# EAGLE design B5_2U_EM_RAB_Ver3 (EAGLE 9.4.2)
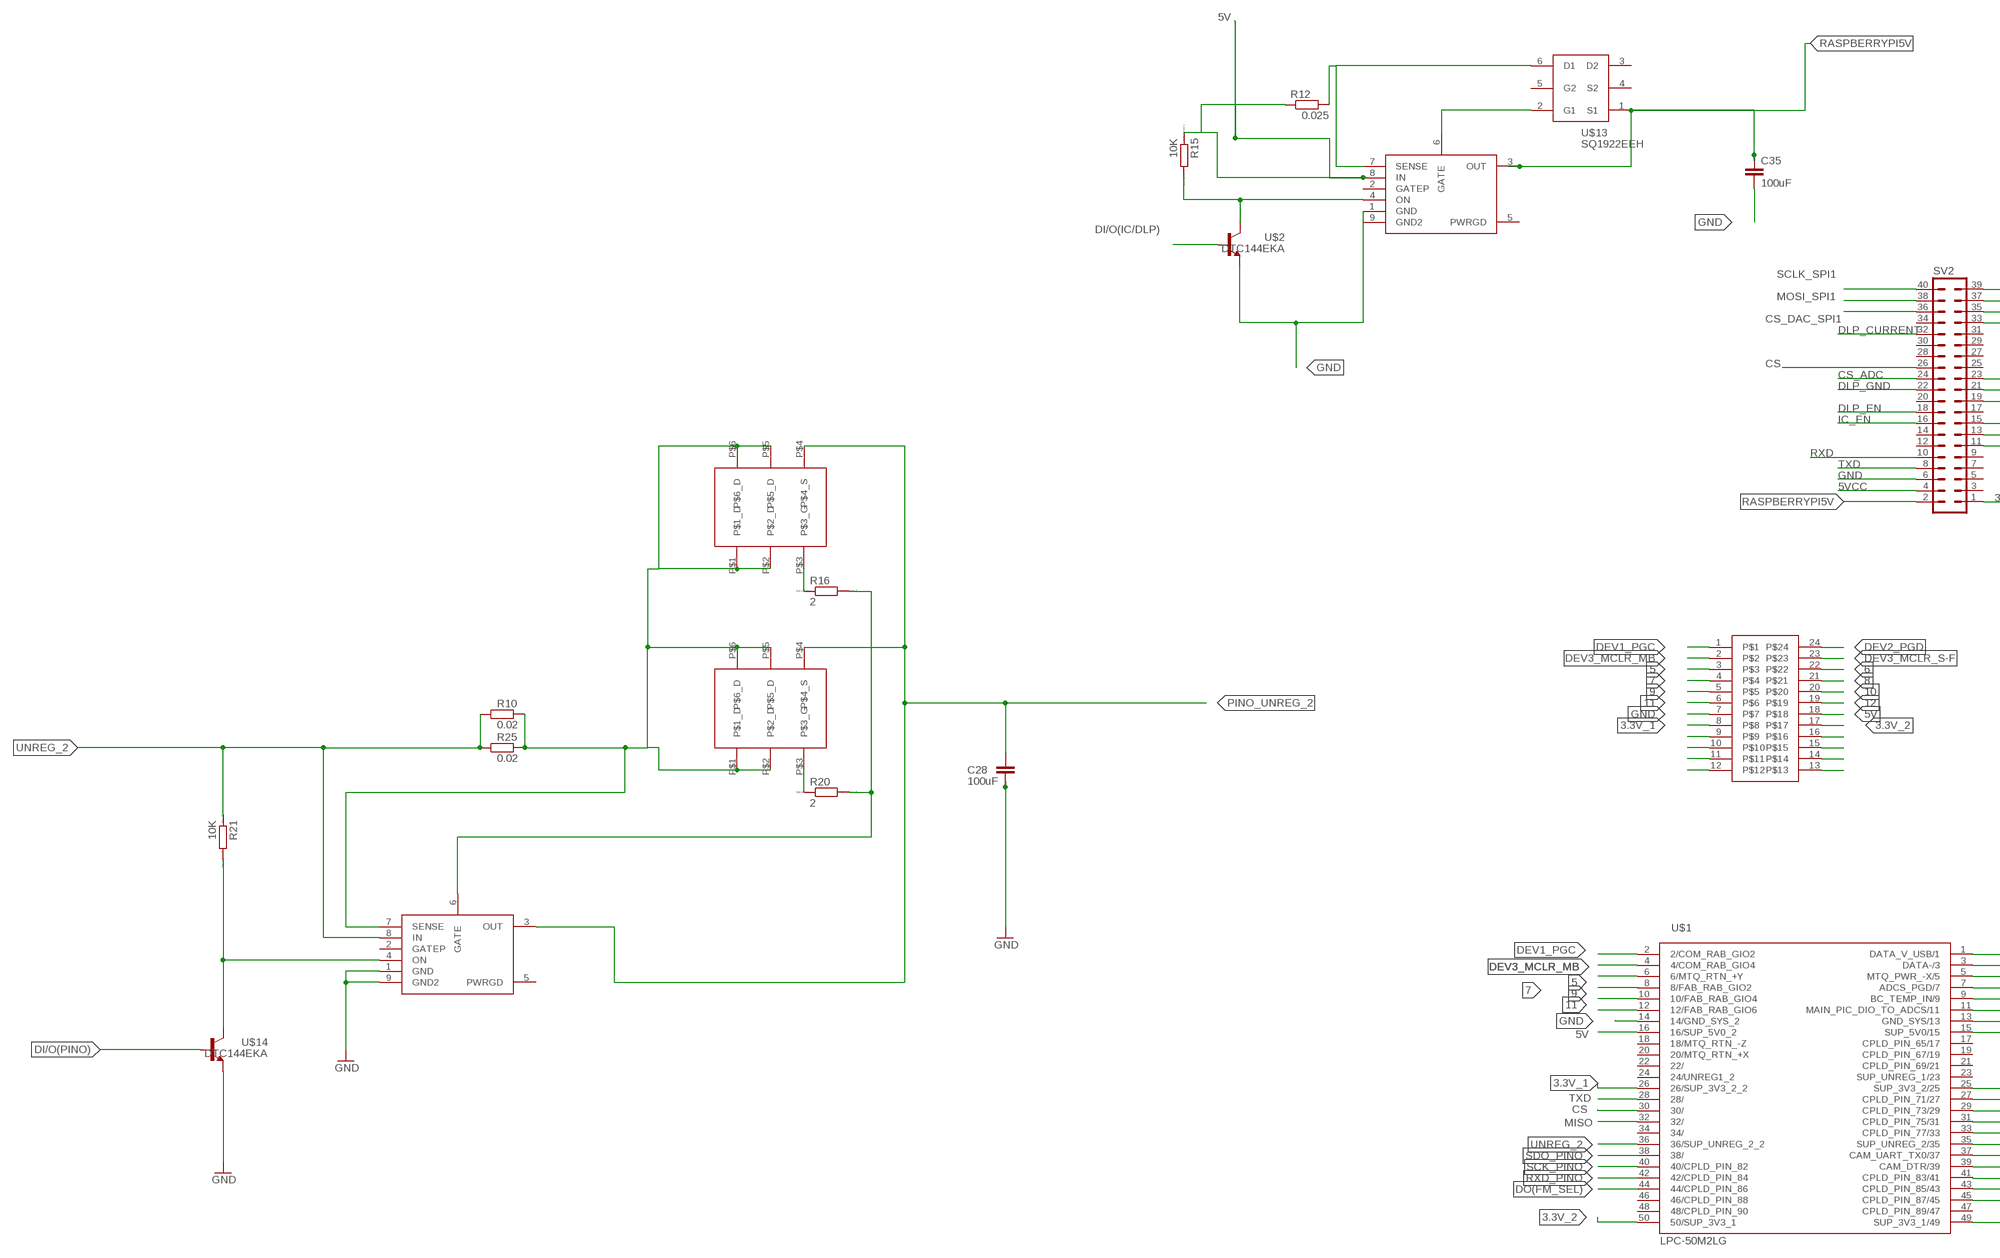
[diagram p0: schematic, sheet 1, part 1 of 2]
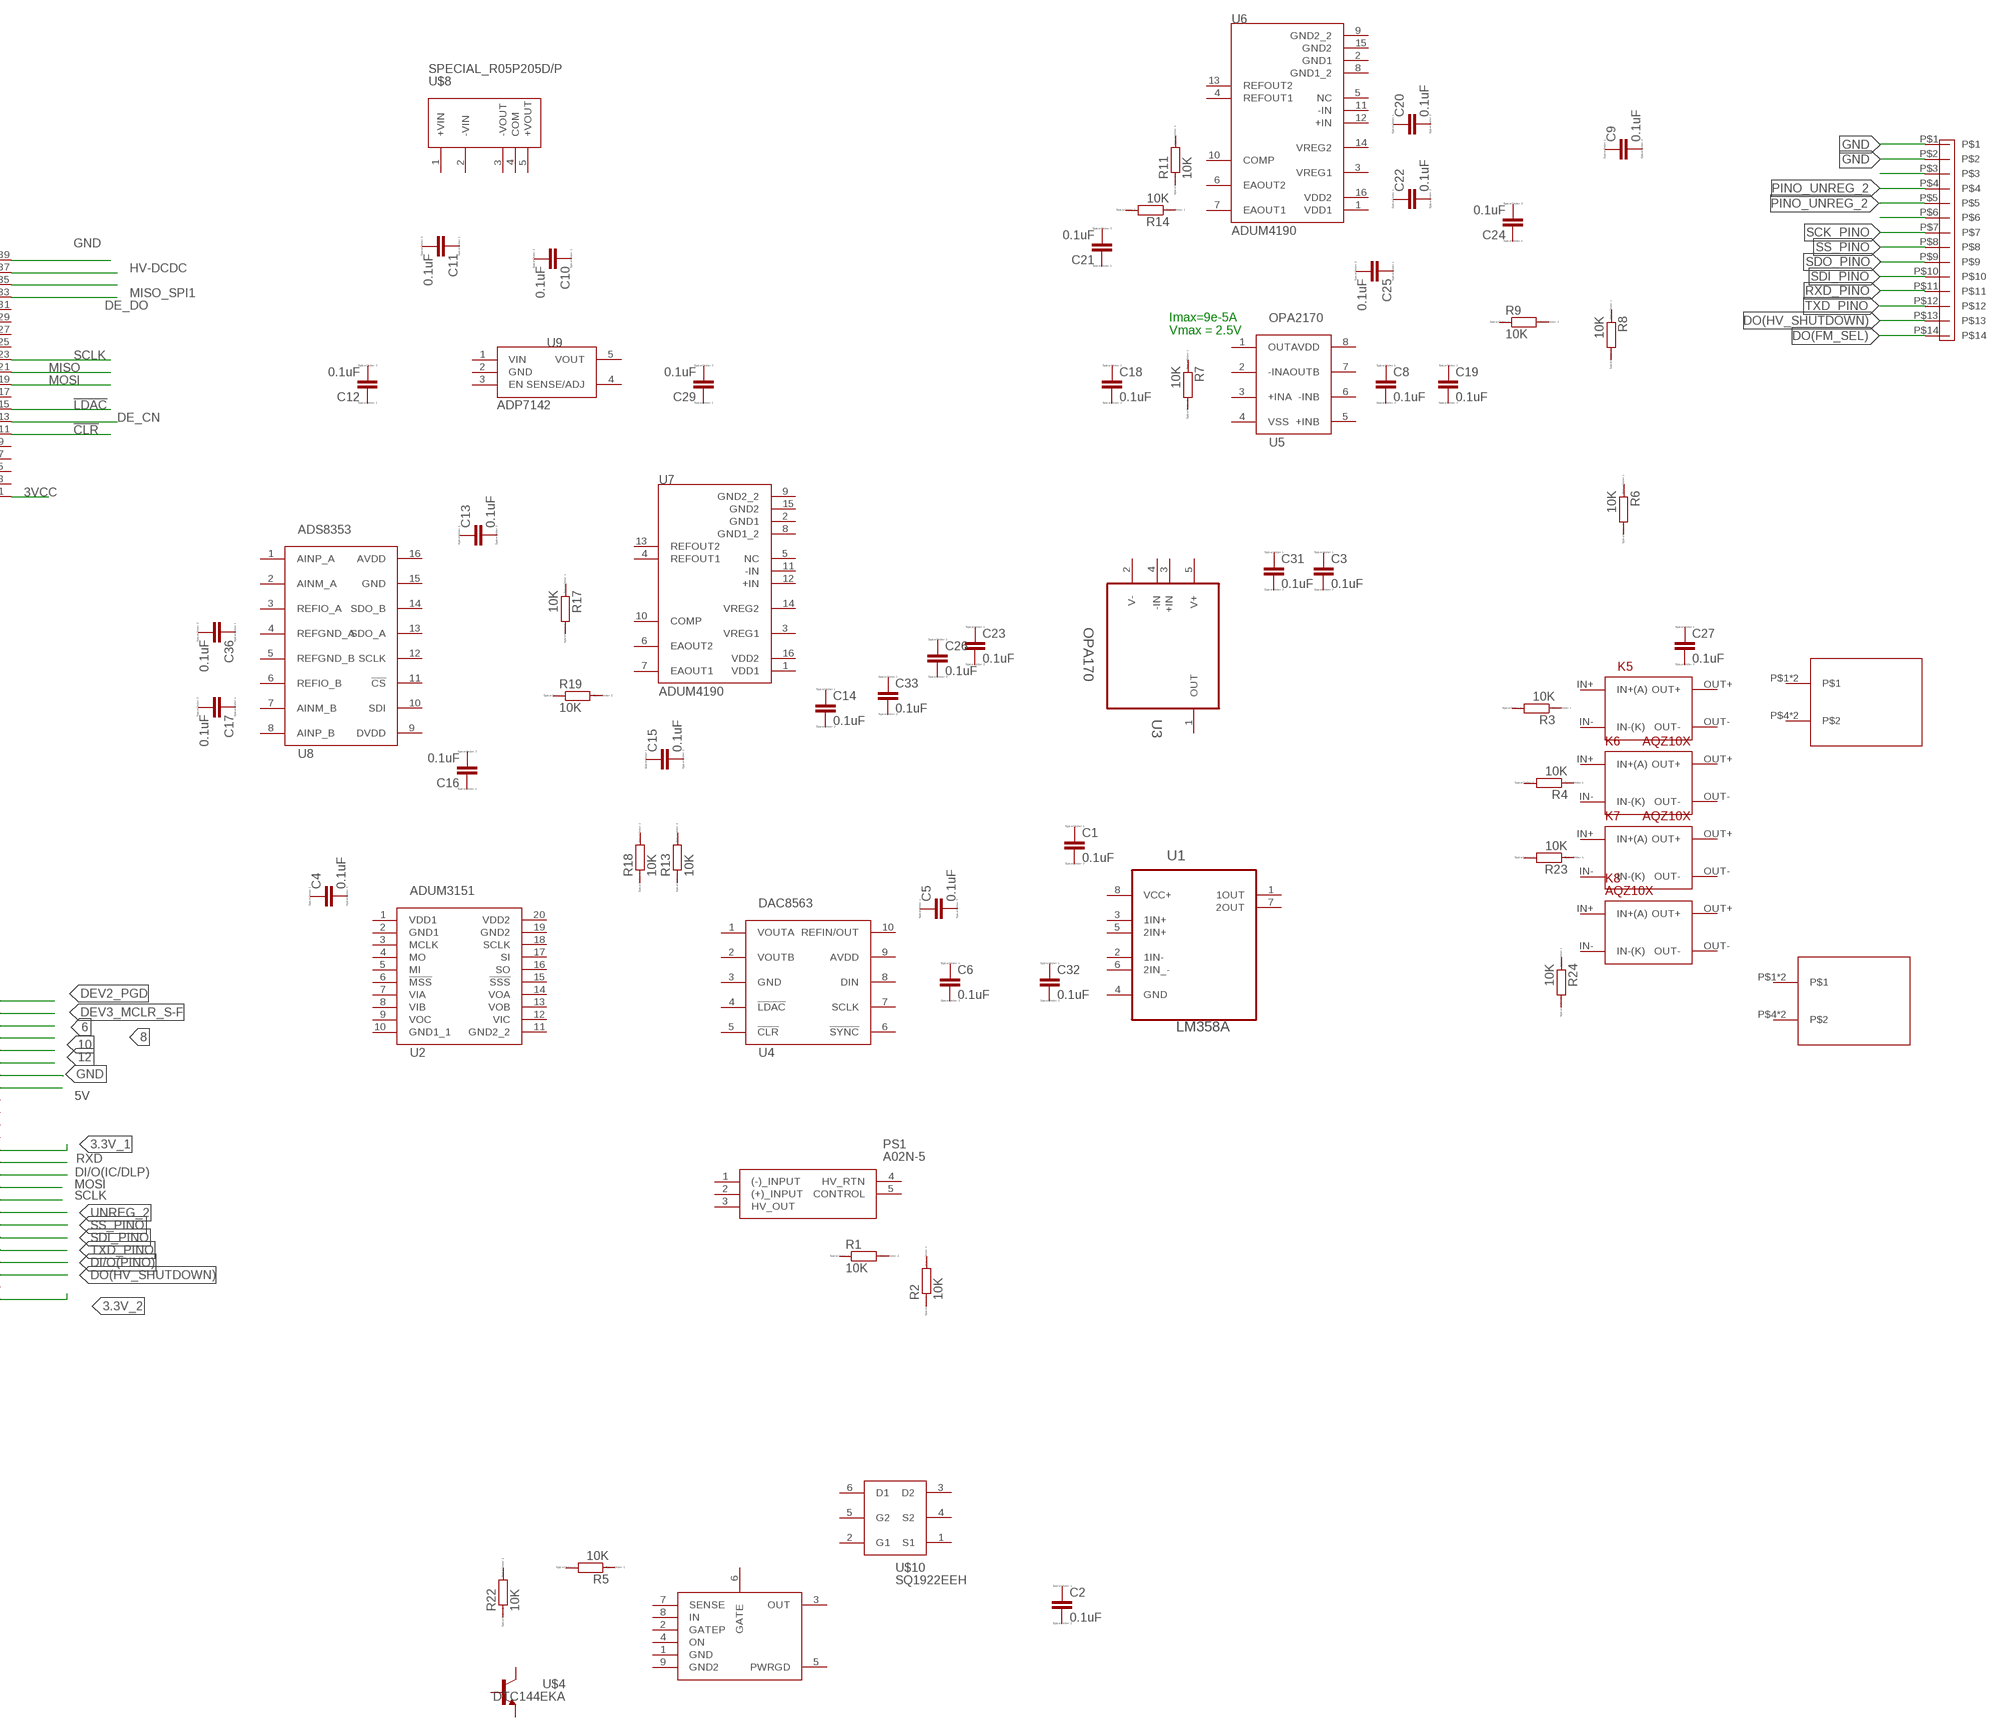
[diagram p1: schematic, sheet 1, part 2 of 2]

## Parts
C1  0.1uF  CC1005  [C1005]
C2  0.1uF  CC1005  [C1005]
C3  0.1uF  CC1005  [C1005]
C4  0.1uF  CC1005  [C1005]
C5  0.1uF  CC1005  [C1005]
C6  0.1uF  CC1005  [C1005]
C8  0.1uF  CC1005  [C1005]
C9  0.1uF  CC1005  [C1005]
C10  0.1uF  CC1005  [C1005]
C11  0.1uF  CC1005  [C1005]
C12  0.1uF  CC1005  [C1005]
C13  0.1uF  CC1005  [C1005]
C14  0.1uF  CC1005  [C1005]
C15  0.1uF  CC1005  [C1005]
C16  0.1uF  CC1005  [C1005]
C17  0.1uF  CC1005  [C1005]
C18  0.1uF  CC1005  [C1005]
C19  0.1uF  CC1005  [C1005]
C20  0.1uF  CC1005  [C1005]
C21  0.1uF  CC1005  [C1005]
C22  0.1uF  CC1005  [C1005]
C23  0.1uF  CC1005  [C1005]
C24  0.1uF  CC1005  [C1005]
C25  0.1uF  CC1005  [C1005]
C26  0.1uF  CC1005  [C1005]
C27  0.1uF  CC1005  [C1005]
C28  100uF  C-EUC0603  [C0603]
C29  0.1uF  CC1005  [C1005]
C31  0.1uF  CC1005  [C1005]
C32  0.1uF  CC1005  [C1005]
C33  0.1uF  CC1005  [C1005]
C35  100uF  C-EUC0805  [C0805]
C36  0.1uF  CC1005  [C1005]
K5  AQZ10X  [AQZ10X]
K6  AQZ10X  [AQZ10X]
K7  AQZ10X  [AQZ10X]
K8  AQZ10X  [AQZ10X]
PS1  A02N-5  [A02N5]
R1  10K  RR1005  [R1005]
R2  10K  RR1005  [R1005]
R3  10K  RR1005  [R1005]
R4  10K  RR1005  [R1005]
R5  10K  RR1005  [R1005]
R6  10K  RR1005  [R1005]
R7  10K  RR1005  [R1005]
R8  10K  RR1005  [R1005]
R9  10K  RR1005  [R1005]
R10  0.02  R-EU_R2512  [R2512]
R11  10K  RR1005  [R1005]
R12  0.025  R-EU_R0805  [R0805]
R13  10K  RR1005  [R1005]
R14  10K  RR1005  [R1005]
R15  10K  RR1005  [R1005]
R16  2  RR1005  [R1005]
R17  10K  RR1005  [R1005]
R18  10K  RR1005  [R1005]
R19  10K  RR1005  [R1005]
R20  2  RR1005  [R1005]
R21  10K  RR1005  [R1005]
R22  10K  RR1005  [R1005]
R23  10K  RR1005  [R1005]
R24  10K  RR1005  [R1005]
R25  0.02  R-EU_R2512  [R2512]
SV2  MA20-2  [MA20-2]
U1  LM358A  LM358ADGKRG4  [SOP65P490X110-8N]
U2  ADUM3151  ADUM3151ARSZ  [SOP65P780X200-20N]
U3  OPA170  OPA170AIDBVT  [SOT95P280X145-5N]
U4  DAC8563  DAC8563SDGST  [SOP50P490X110-10N]
U5  OPA2170  OPA2170R  [R-PDSO-G8]
U6  ADUM4190  ADUM4190ARIZ  [SOIC-16_RI-16-12]
U7  ADUM4190  ADUM4190ARIZ  [SOIC-16_RI-16-12]
U8  ADS8353  ADS8353IPWR  [SOP65P640X120-16N]
U9  ADP7142  ADP7142AUJZ-5.0-R7  [SOT95P280X100-5N]
U$1  LPC-50M2LG  [LPC-50M2LG]
U$2  DTC144EKA  BIRDS3_CAM_MSN_DTC144EKA  [BIRDS3_CAM_MSN_SOT346-R]
U$3  RAB_CONECTOR  [HDRVR24W40P127_2X12_1564X310X455B]
U$4  DTC144EKA  BIRDS3_CAM_MSN_DTC144EKA  [BIRDS3_CAM_MSN_SOT346-R]
U$5  B14B-PASK-1  [B14B-PASK-1]
U$6  BIRDS5_LTC4361  [BIRDS5_LTC4361]
U$7  DF61_DF61  [DF61_DF61Y]
U$8  SPECIAL_R05P205D/P  [SPECIAL_R05P205D/P]
U$9  DF61_DF61  [DF61_DF61Y]
U$10  SQ1922EEH  BIRDS3_CAM_MSN_SQ1922EEH  [BIRDS3_CAM_MSN_SOT65P210X110-6N]
U$11  BIRDS5_LTC4361  [BIRDS5_LTC4361]
U$12  BIRDS5_LTC4361  [BIRDS5_LTC4361]
U$13  SQ1922EEH  BIRDS3_CAM_MSN_SQ1922EEH  [BIRDS3_CAM_MSN_SOT65P210X110-6N]
U$14  DTC144EKA  BIRDS3_CAM_MSN_DTC144EKA  [BIRDS3_CAM_MSN_SOT346-R]
U$15  SSM6K411TU  [SSM6K411TU]
U$16  SSM6K411TU  [SSM6K411TU]

## Nets
3.3V_1: U$1.25(SUP_3V3_2/25) U$1.26(26/SUP_3V3_2_2) U$3.8
3.3V_2: U$1.49(SUP_3V3_1/49) U$1.50(50/SUP_3V3_1) U$3.17
3VCC: SV2.1
5: U$1.6(6/MTQ_RTN_+Y) U$3.3
5V: R12.1 R15.1 U$1.15(SUP_5V0/15) U$1.16(16/SUP_5V0_2) U$3.18 U$6.8(IN)
5VCC: SV2.4
6: U$1.5(MTQ_PWR_-X/5) U$3.22
7: U$1.8(8/FAB_RAB_GIO2) U$3.4
8: U$1.7(ADCS_PGD/7) U$3.21
9: U$1.10(10/FAB_RAB_GIO4) U$3.5
10: U$1.9(BC_TEMP_IN/9) U$3.20
11: U$1.12(12/FAB_RAB_GIO6) U$3.6
12: U$1.11(MAIN_PIC_DIO_TO_ADCS/11) U$3.19
!CLR: SV2.11
!LDAC: SV2.15
CS: SV2.26 U$1.30(30/)
CS_ADC: SV2.24
CS_DAC_SPI1: SV2.36
DE_CN: SV2.13
DE_DO: SV2.33
DEV1_PGC: U$1.2(2/COM_RAB_GIO2) U$3.1
DEV2_PGD: U$1.1(DATA_V_USB/1) U$3.24
DEV3_MCLR_MB: U$1.4(4/COM_RAB_GIO4) U$3.2
DEV3_MCLR_S-F: U$1.3(DATA-/3) U$3.23
DI/O(IC/DLP): U$1.29(CPLD_PIN_73/29) U$2.2(B)
DI/O(PINO): U$1.43(CPLD_PIN_85/43) U$14.2(B)
DLP_CURRENT: SV2.32
DLP_EN: SV2.18
DLP_GND: SV2.22
DO(FM_SEL): U$1.44(44/CPLD_PIN_86) U$5.P$14
DO(HV_SHUTDOWN): U$1.45(CPLD_PIN_87/45) U$5.P$13
GND: C28.2 C35.2 SV2.6 SV2.39 U$1.13(GND_SYS/13) U$1.14(14/GND_SYS_2) U$2.1(E) U$3.7 U$5.P$1 U$5.P$2 U$6.1(GND) U$6.9(GND2) U$12.1(GND) U$12.9(GND2) U$14.1(E)
HV-DCDC: SV2.37
IC_EN: SV2.16
MISO: SV2.21 U$1.32(32/)
MISO_SPI1: SV2.35
MOSI: SV2.19 U$1.31(CPLD_PIN_75/31)
MOSI_SPI1: SV2.38
N$2: R20.1 U$15.P$3(P$3_G)
N$3: R16.1 U$16.P$3(P$3_G)
N$5: R10.2 R25.2 U$12.7(SENSE) U$15.P$1(P$1_D) U$15.P$2(P$2_D) U$15.P$5(P$5_D) U$15.P$6(P$6_D) U$16.P$1(P$1_D) U$16.P$2(P$2_D) U$16.P$5(P$5_D) U$16.P$6(P$6_D)
N$14: R15.2 U$2.3(C) U$6.4(ON)
N$15: U$5.P$6
N$21: U$5.P$3
N$32: U$3.9
N$44: U$3.10
N$47: U$3.11
N$48: U$3.12
N$49: U$3.13
N$50: U$3.14
N$51: U$3.15
N$52: U$3.16
N$53: R12.2 U$6.7(SENSE) U$13.6(D1)
N$56: U$6.6(GATE) U$13.2(G1)
N$66: R21.2 U$12.4(ON) U$14.3(C)
N$75: R16.2 R20.2 U$12.6(GATE)
PINO_UNREG_2: C28.1 U$5.P$4 U$5.P$5 U$12.3(OUT) U$15.P$4(P$4_S) U$16.P$4(P$4_S)
RASPBERRYPI5V: C35.1 SV2.2 U$6.3(OUT) U$13.1(S1)
RXD: SV2.10 U$1.27(CPLD_PIN_71/27)
RXD_PINO: U$1.42(42/CPLD_PIN_84) U$5.P$11
SCK_PINO: U$1.40(40/CPLD_PIN_82) U$5.P$7
SCLK: SV2.23 U$1.33(CPLD_PIN_77/33)
SCLK_SPI1: SV2.40
SDI_PINO: U$1.39(CAM_DTR/39) U$5.P$10
SDO_PINO: U$1.38(38/) U$5.P$9
SS_PINO: U$1.37(CAM_UART_TX0/37) U$5.P$8
TXD: SV2.8 U$1.28(28/)
TXD_PINO: U$1.41(CPLD_PIN_83/41) U$5.P$12
UNREG_2: R10.1 R21.1 R25.1 U$1.35(SUP_UNREG_2/35) U$1.36(36/SUP_UNREG_2_2) U$12.8(IN)
Unconnected: C1.1 C1.2 C2.1 C2.2 C3.1 C3.2 C4.1 C4.2 C5.1 C5.2 C6.1 C6.2 C8.1 C8.2 C9.1 C9.2 C10.1 C10.2 C11.1 C11.2 C12.1 C12.2 C13.1 C13.2 C14.1 C14.2 C15.1 C15.2 C16.1 C16.2 C17.1 C17.2 C18.1 C18.2 C19.1 C19.2 C20.1 C20.2 C21.1 C21.2 C22.1 C22.2 C23.1 C23.2 C24.1 C24.2 C25.1 C25.2 C26.1 C26.2 C27.1 C27.2 C29.1 C29.2 C31.1 C31.2 C32.1 C32.2 C33.1 C33.2 C36.1 C36.2 K5.IN+(IN+(A)) K5.IN-(IN-(K)) K5.OUT+ K5.OUT- K6.IN+(IN+(A)) K6.IN-(IN-(K)) K6.OUT+ K6.OUT- K7.IN+(IN+(A)) K7.IN-(IN-(K)) K7.OUT+ K7.OUT- K8.IN+(IN+(A)) K8.IN-(IN-(K)) K8.OUT+ K8.OUT- PS1.1((-)_INPUT) PS1.2((+)_INPUT) PS1.3(HV_OUT) PS1.4(HV_RTN) PS1.5(CONTROL) R1.1 R1.2 R2.1 R2.2 R3.1 R3.2 R4.1 R4.2 R5.1 R5.2 R6.1 R6.2 R7.1 R7.2 R8.1 R8.2 R9.1 R9.2 R11.1 R11.2 R13.1 R13.2 R14.1 R14.2 R17.1 R17.2 R18.1 R18.2 R19.1 R19.2 R22.1 R22.2 R23.1 R23.2 R24.1 R24.2 SV2.3 SV2.5 SV2.7 SV2.9 SV2.12 SV2.14 SV2.17 SV2.20 SV2.25 SV2.27 SV2.28 SV2.29 SV2.30 SV2.31 SV2.34 U1.1(1OUT) U1.2(1IN-) U1.3(1IN+) U1.4(GND) U1.5(2IN+) U1.6(2IN_-) U1.7(2OUT) U2.1(VDD1) U2.2(GND1) U2.3(MCLK) U2.4(MO) U2.5(MI) U2.6(!MSS) U2.7(VIA) U2.8(VIB) U2.9(VOC) U2.10(GND1_1) U2.11(GND2_2) U2.12(VIC) U2.13(VOB) U2.14(VOA) U2.15(!SSS) U2.16(SO) U2.17(SI) U2.18(SCLK) U2.19(GND2) U2.20(VDD2) U3.1(OUT) U3.2(V-) U3.3(+IN) U3.4(-IN) U4.1(VOUTA) U4.2(VOUTB) U4.3(GND) U4.4(!LDAC) U4.5(!CLR) U4.6(!SYNC) U4.7(SCLK) U4.8(DIN) U4.9(AVDD) U4.10(REFIN/OUT) U5.1(OUTA) U5.2(-INA) U5.3(+INA) U5.4(VSS) U5.5(+INB) U5.6(-INB) U5.7(OUTB) U5.8(VDD) U6.1(VDD1) U6.2(GND1) U6.3(VREG1) U6.4(REFOUT1) U6.5(NC) U6.6(EAOUT2) U6.7(EAOUT1) U6.8(GND1_2) U6.9(GND2_2) U6.10(COMP) U6.11(-IN) U6.12(+IN) U6.13(REFOUT2) U6.14(VREG2) U6.15(GND2) U6.16(VDD2) U7.1(VDD1) U7.2(GND1) U7.3(VREG1) U7.4(REFOUT1) U7.5(NC) U7.6(EAOUT2) U7.7(EAOUT1) U7.8(GND1_2) U7.9(GND2_2) U7.10(COMP) U7.11(-IN) U7.12(+IN) U7.13(REFOUT2) U7.14(VREG2) U7.15(GND2) U7.16(VDD2) U8.1(AINP_A) U8.2(AINM_A) U8.3(REFIO_A) U8.4(REFGND_A) U8.5(REFGND_B) U8.6(REFIO_B) U8.7(AINM_B) U8.8(AINP_B) U8.9(DVDD) U8.10(SDI) U8.11(!CS) U8.12(SCLK) U8.13(SDO_A) U8.14(SDO_B) U8.15(GND) U8.16(AVDD) U9.1(VIN) U9.2(GND) U9.3(EN) U9.4(SENSE/ADJ) U9.5(VOUT) U$1.17(CPLD_PIN_65/17) U$1.18(18/MTQ_RTN_-Z) U$1.19(CPLD_PIN_67/19) U$1.20(20/MTQ_RTN_+X) U$1.21(CPLD_PIN_69/21) U$1.22(22/) U$1.23(SUP_UNREG_1/23) U$1.24(24/UNREG1_2) U$1.34(34/) U$1.46(46/CPLD_PIN_88) U$1.47(CPLD_PIN_89/47) U$1.48(48/CPLD_PIN_90) U$4.1(E) U$4.2(B) U$4.3(C) U$6.2(GATEP) U$6.5(PWRGD) U$7.P$1 U$7.P$2 U$7.P$4 U$7.P$5 U$8.1(+VIN) U$8.2(-VIN) U$8.3(-VOUT) U$8.4(COM) U$8.5(+VOUT) U$9.P$1 U$9.P$2 U$9.P$4 U$9.P$5 U$10.1(S1) U$10.2(G1) U$10.3(D2) U$10.4(S2) U$10.5(G2) U$10.6(D1) U$11.1(GND) U$11.2(GATEP) U$11.3(OUT) U$11.4(ON) U$11.5(PWRGD) U$11.6(GATE) U$11.7(SENSE) U$11.8(IN) U$11.9(GND2) U$12.2(GATEP) U$12.5(PWRGD) U$13.3(D2) U$13.4(S2) U$13.5(G2)

## Notes on the sheet
- Imax=9e-5A
  Vmax = 2.5V

## Power pins joined to a net without a drawn wire
V+: U3.5(V+)
VCC+: U1.8(VCC+)

## Library data of the parts
C1-C6 C8-C27 C29 C31-C33 C36 = eagle-ltspice:C: CAPACITOR, European symbol; SPICEMODEL: NONE; SPICEPREFIX: C
C28 C35 = rcl:C-EU: CAPACITOR, European symbol; SPICEPREFIX: C
K5-K8 = b4_photomos:AQZ10X
PS1 = SamacSys_Parts:A02N-5: Isolated DC/DC Converters SINGLE O/P, DC-HV DC PCB MOUNT, 1W, -200V Source: Datasheet <https://componentsearchengine.com/Datasheets/2/A02N-5.pdf>; DESCRIPTION: Isolated DC/DC Converters SINGLE O/P, DC-HV DC PCB MOUNT, 1W, -200V; HEIGHT: 6.35mm; MANUFACTURER_NAME: XP POWER; MANUFACTURER_PART_NUMBER: A02N-5; MOUSER_PART_NUMBER: 209-A02N-5; MOUSER_PRICE-STOCK: https://www.mouser.com/Search/Refine.aspx?Keyword=209-A02N-5
R1-R9 R11 R13-R24 = eagle-ltspice:R: RESISTOR, European symbol; SPICEMODEL: NONE; SPICEPREFIX: R
R10 R25 = rcl:R-EU_: RESISTOR, European symbol; SPICEPREFIX: R
R12 = resistor:R-EU_: RESISTOR, European symbol
SV2 = con-lstb:MA20-2: PIN HEADER; OC_FARNELL: unknown; OC_NEWARK: unknown
U1 = Texas Instruments_By_element14_Batch_1:LM358ADGKRG4: 0.05ìV/°C max, SINGLE-SUPPLY CMOS OPERATIONAL AMPLIFIERS Zer.-Drift Series; MPN: LM358ADGKRG4; OC_FARNELL: 1535734; OC_NEWARK: 70K2995; PACKAGE: MSOP-8; SUPPLIER: Texas Instruments
U2 = Texas Instruments_By_element14_Batch_1:ADUM3151ARSZ: DGTL ISO 3.75KV 7CH SPI 20SSOP
U3 = Texas Instruments_By_element14_Batch_1:OPA170AIDBVT: OPERATIONAL AMPLIFIERS; MPN: OPA170AIDBVT; OC_FARNELL: 2057089; OC_NEWARK: 64T3747; PACKAGE: SOT-23-5; SUPPLIER: Texas Instruments
U4 = Texas Instruments_By_element14_Batch_1:DAC8563SDGST: Texas Instruments 16 Bits Digital to Analog
U5 = Texas Instruments_By_element14_Batch_1:OPA2170
U6 U7 = Texas Instruments_By_element14_Batch_1:ADUM4190ARIZ: ADUM4190ARIZ
U8 = Texas Instruments_By_element14_Batch_1:ADS8353IPWR: 16 Bit Analog to Digital Converter 2 Input 2 SAR 16-TSSOP 1MSPS SINCOS SAR A/D CONVERTER
U9 = AD5761BRUZ:ADP7142AUJZ-5.0-R7: ADP7142AUJZ-5.0-R7
U$1 = BIRDS3_Tha_lib:LPC-50M2LG
U$2 U$4 U$14 = MissionBoard2_RPI V5_Final:BIRDS3_CAM_MSN_DTC144EKA
U$3 = RAB_conector:RAB_CONECTOR
U$5 = PINO:B14B-PASK-1
U$6 U$11 U$12 = BIRDS5_LTC4361:BIRDS5_LTC4361
U$7 U$9 = B5_EM_RAB_Ver3:DF61_DF61
U$8 = B5_EM_RAB_Ver3:SPECIAL_R05P205D/P: DC DC CONVERTER +/-5V 2W
U$10 U$13 = MissionBoard2_RPI V5_Final:BIRDS3_CAM_MSN_SQ1922EEH
U$15 U$16 = SSM6K411TU:SSM6K411TU

## Board
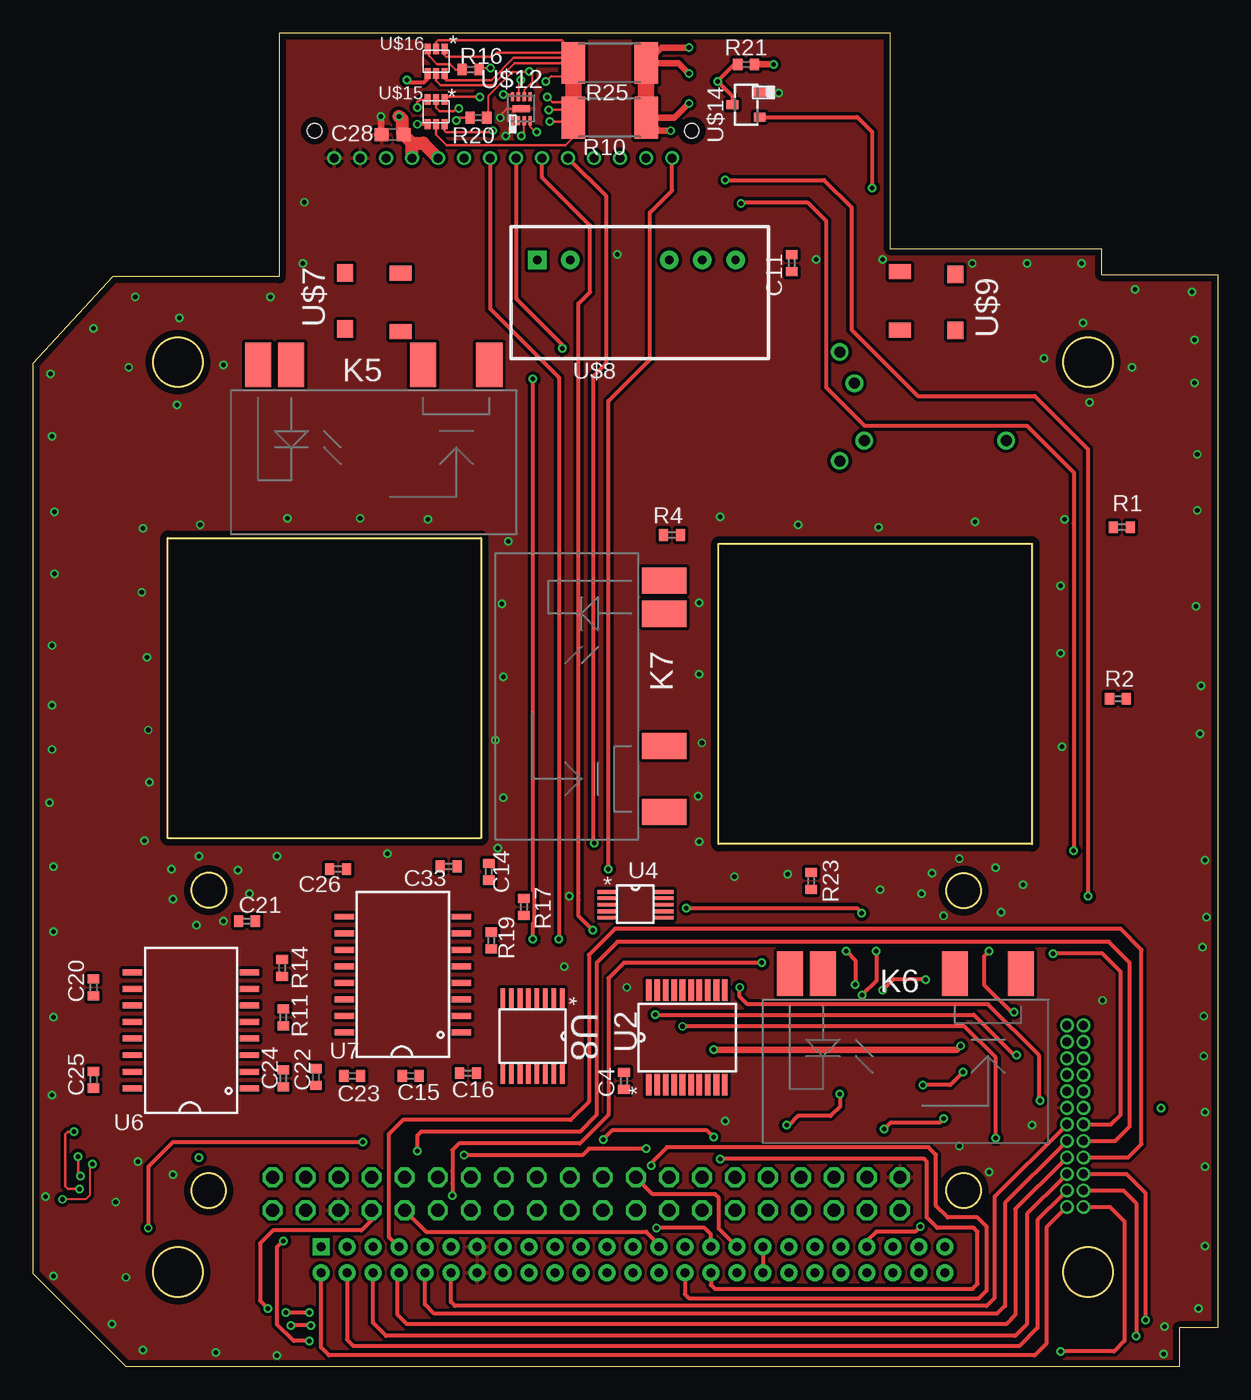
[diagram p2: board, top side]
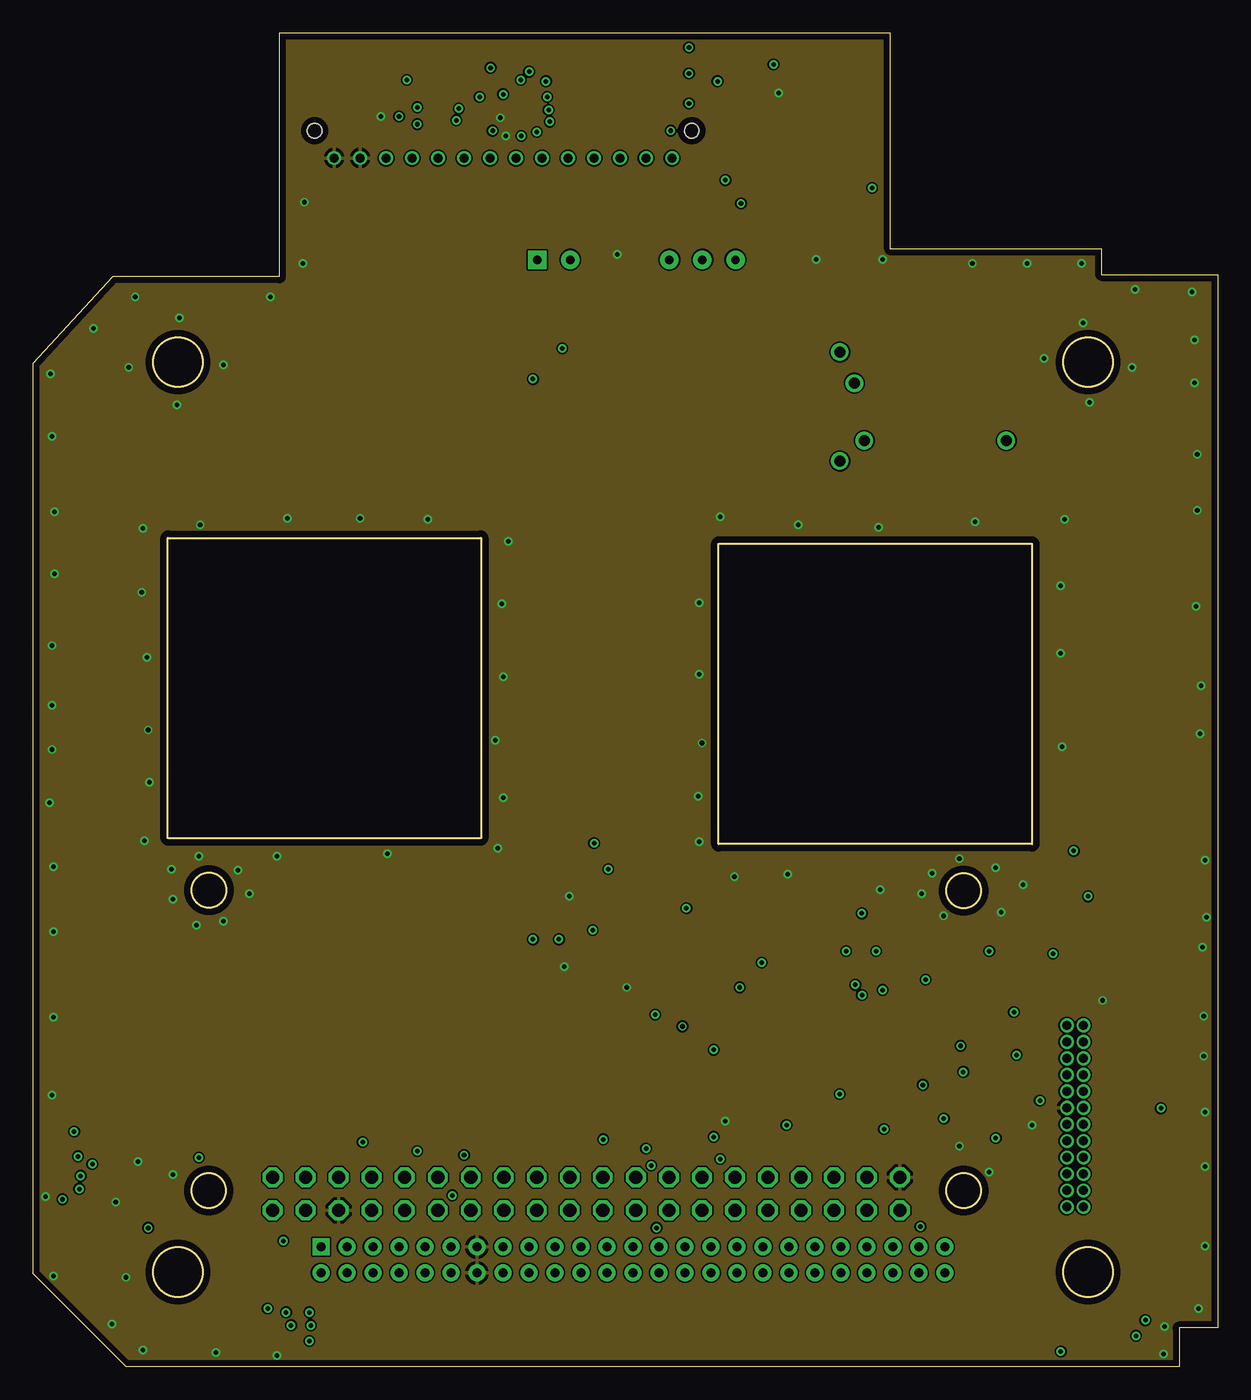
[diagram p3: board, inner layer GND]
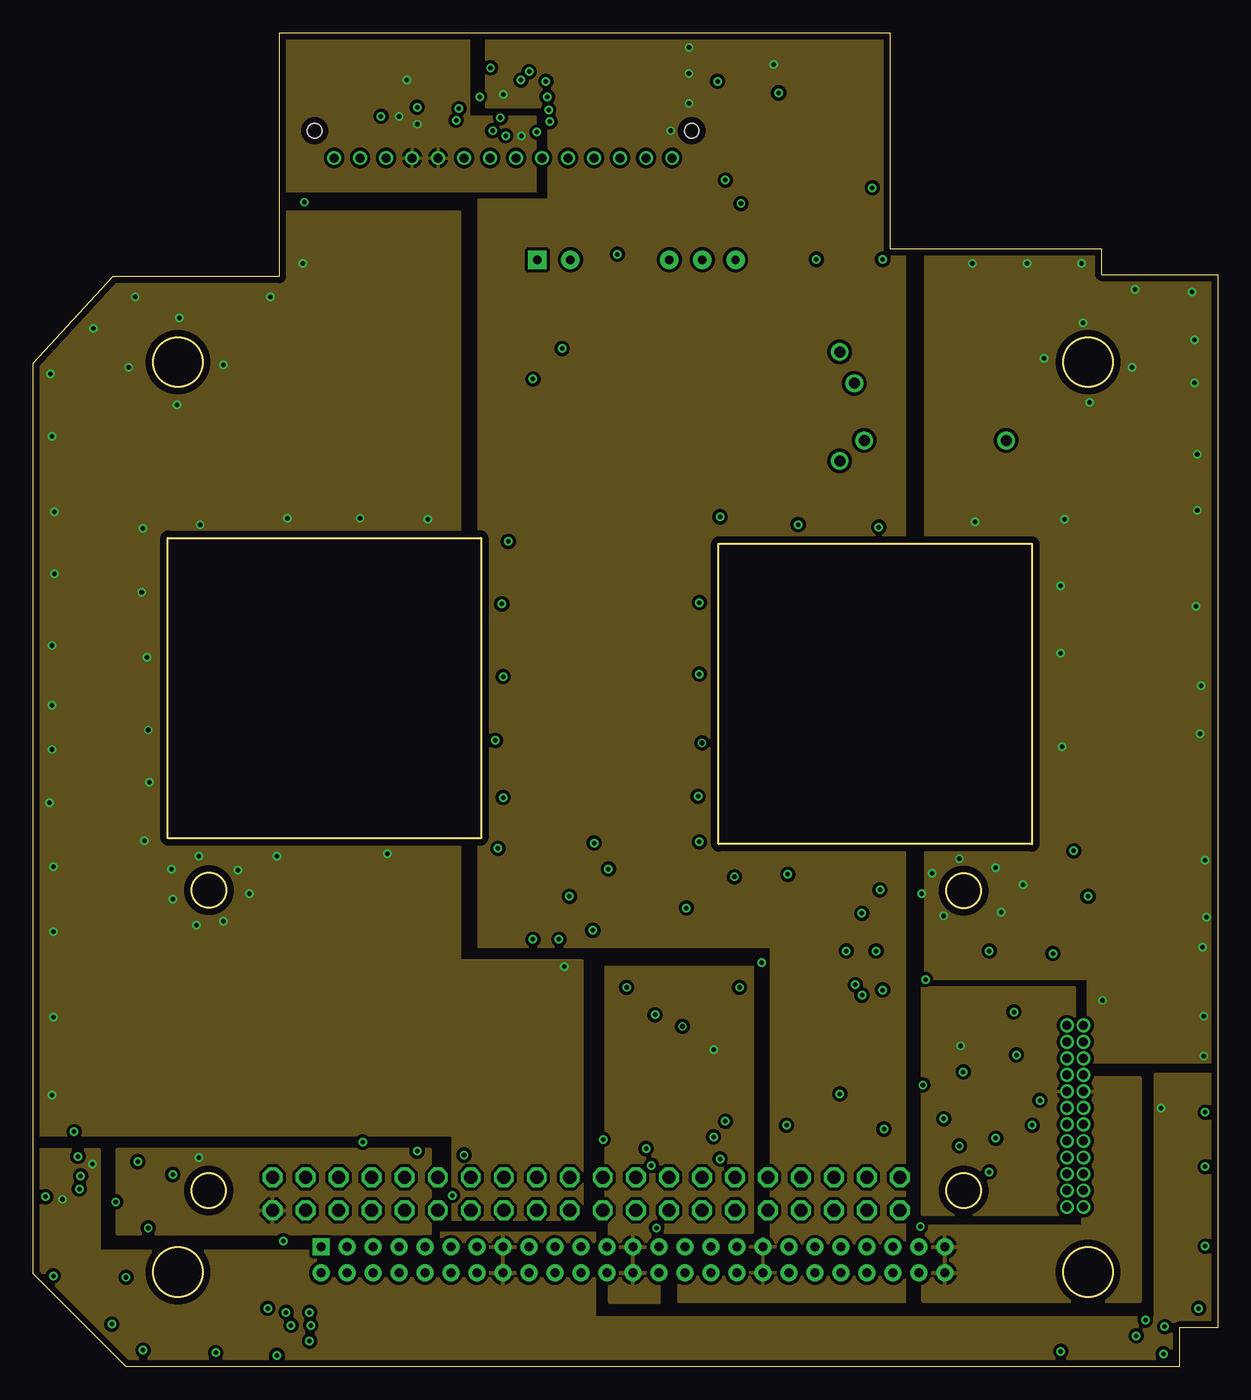
[diagram p4: board, inner layer power2]
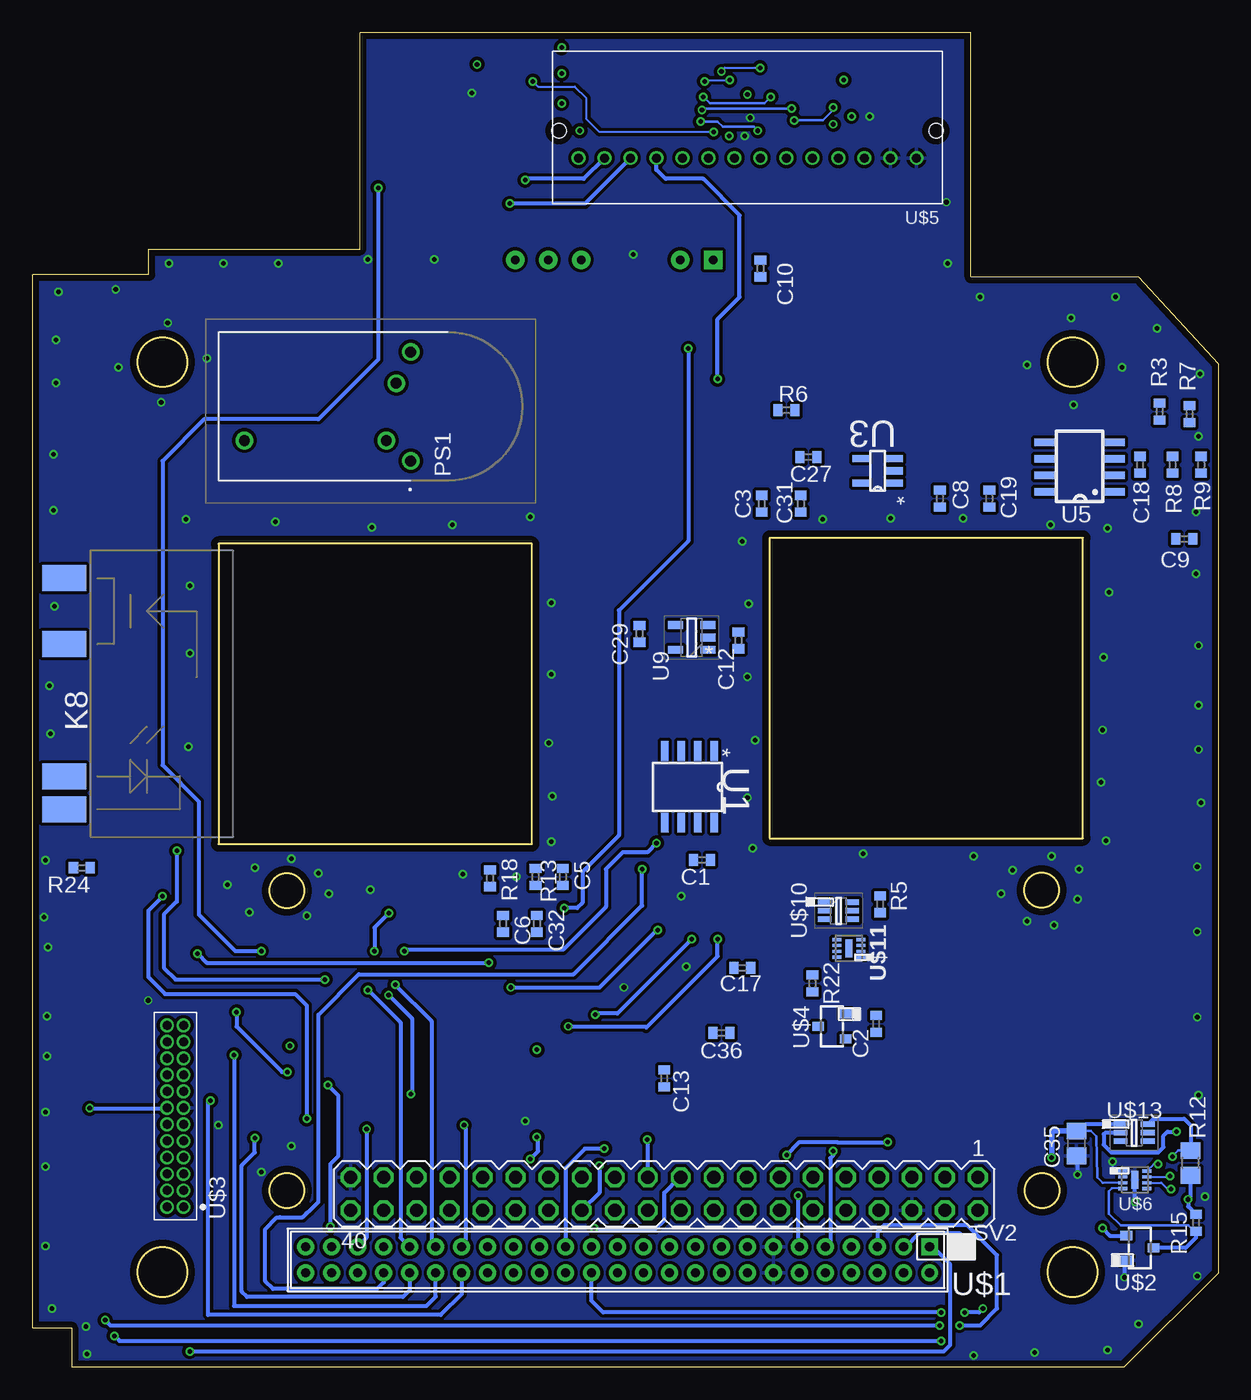
[diagram p5: board, bottom side, seen from below]

Size 91.2 x 102.65 mm. Coordinates in mm from the lower left corner, seen from the top.
Outline: 52.79,63.33 76.89,63.33 76.89,40.23 52.79,40.23 52.79,63.33
Outline: 10.4,63.77 34.5,63.77 34.5,40.67 10.4,40.67 10.4,63.77
Outline: 91.2,3 91.2,84.04 82.25,84.04 82.25,86 66,86 66,102.65 19,102.65 19,83.85 6.15,83.85 0,77.19 0,7.2 7.2,0 88.2,0 88.2,3 91.2,3
Outline: circle at 13.58,36.66 radius 1.32
Outline: circle at 71.63,13.57 radius 1.32
Outline: circle at 13.55,13.56 radius 1.32
Outline: circle at 81.2,7.3 radius 1.9
Outline: circle at 71.63,36.65 radius 1.32
Outline: circle at 11.2,7.3 radius 1.9
Outline: circle at 11.2,77.3 radius 1.9
Outline: circle at 81.2,77.3 radius 1.9
Copper layers (1+2*15+16): Top 0.018mm / dielectric 0.25mm / GND 0.035mm / dielectric 1mm / power2 0.035mm / dielectric 0.25mm / Bottom 0.018mm
Design rules "pban_5mil-l4": minimum track width 5mil, minimum drill 0.3mm, track to track 5mil, track to pad 0.229mm, pad to pad 5mil, via to via 5mil, smd to smd 5mil, copper to edge 0.5mm, drill to drill 0.5mm, minimum pad ring 0.15mm, minimum via ring 0.15mm, stop-mask expansion 4mil, vias tented up to drill 0.35mm, thermal gap 10mil

### Footprints (pad centres in the part's own frame; a part is rotated, then mirrored left to right if it is on the bottom)
C1005 = smd 0.7 x 0.9: 1 -0.65,0; 2 0.65,0
C0603 = smd 1.1 x 1: 1 -0.85,0; 2 0.85,0
C0805 = smd 1.3 x 1.5: 1 -0.95,0; 2 0.95,0
AQZ10X = smd 3.4 x 2: IN+ 0,-6.35; IN- 0,-8.89; OUT+ 0,8.89; OUT- 0,3.81
A02N5 = drill 0.84 pad 1.365: 1 0,0; 2 -1.12,5.97; 3 -12.8,1.57; 4 -1.88,1.57; 5 0,8.38
R1005 = smd 0.7 x 0.9: 1 -0.65,0; 2 0.65,0
R2512 = smd 1.8 x 3.2: 1 -2.8,0; 2 2.8,0
R0805 = smd 1.3 x 1.5: 1 -0.95,0; 2 0.95,0
MA20-2 = drill 1.016 octagon: 1 -24.13,-1.27; 2 -24.13,1.27; 3 -21.59,-1.27; 4 -21.59,1.27; 5 -19.05,-1.27; 6 -19.05,1.27; 7 -16.51,-1.27; 8 -16.51,1.27; 9 -13.97,-1.27; 10 -13.97,1.27; 11 -11.43,-1.27; 12 -11.43,1.27; 13 -8.89,-1.27; 14 -8.89,1.27; 15 -6.35,-1.27; 16 -6.35,1.27; 17 -3.81,-1.27; 18 -3.81,1.27; 19 -1.27,-1.27; 20 -1.27,1.27; 21 1.27,-1.27; 22 1.27,1.27; 23 3.81,-1.27; 24 3.81,1.27; 25 6.35,-1.27; 26 6.35,1.27; 27 8.89,-1.27; 28 8.89,1.27; 29 11.43,-1.27; 30 11.43,1.27; 31 13.97,-1.27; 32 13.97,1.27; 33 16.51,-1.27; 34 16.51,1.27; 35 19.05,-1.27; 36 19.05,1.27; 37 21.59,-1.27; 38 21.59,1.27; 39 24.13,-1.27; 40 24.13,1.27
SOP65P490X110-8N = smd 1.52 x 0.6: 1 -2.76,1.27; 2 -2.76,0; 3 -2.76,-1.27; 4 -2.76,-2.54; 5 2.76,-2.54; 6 2.76,-1.27; 7 2.76,0; 8 2.76,1.27
SOP65P780X200-20N = smd 1.651 x 0.432: 1 -3.632,2.921; 2 -3.632,2.286; 3 -3.632,1.626; 4 -3.632,0.965; 5 -3.632,0.33; 6 -3.632,-0.33; 7 -3.632,-0.965; 8 -3.632,-1.626; 9 -3.632,-2.286; 10 -3.632,-2.921; 11 3.632,-2.921; 12 3.632,-2.286; 13 3.632,-1.626; 14 3.632,-0.965; 15 3.632,-0.33; 16 3.632,0.33; 17 3.632,0.965; 18 3.632,1.626; 19 3.632,2.286; 20 3.632,2.921
SOT95P280X145-5N = smd 1.27 x 0.559: 1 -1.295,0.94; 2 -1.295,0; 3 -1.295,-0.94; 4 1.295,-0.94; 5 1.295,0.94
SOP50P490X110-10N = smd 1.422 x 0.279: 1 -2.2,0.991; 2 -2.2,0.508; 3 -2.2,0; 4 -2.2,-0.508; 5 -2.2,-0.991; 6 2.2,-0.991; 7 2.2,-0.508; 8 2.2,0; 9 2.2,0.508; 10 2.2,0.991
R-PDSO-G8 = smd 1.55 x 0.6: 1 -2.7,1.27; 2 -2.7,0; 3 -2.7,-1.27; 4 -2.7,-2.54; 5 2.7,-2.54; 6 2.7,-1.27; 7 2.7,0; 8 2.7,1.27
SOIC-16_RI-16-12 = smd 0.46 x 1.505: 1 6.35,7; 2 5.08,7; 3 3.81,7; 4 2.54,7; 5 1.27,7; 6 0,7; 7 -1.27,7; 8 -2.54,7; 9 -2.54,-2.01; 10 -1.27,-2.01; 11 0,-2.01; 12 1.27,-2.01; 13 2.54,-2.01; 14 3.81,-2.01; 15 5.08,-2.01; 16 6.35,-2.01
SOP65P640X120-16N = smd 1.473 x 0.356: 1 -2.921,2.286; 2 -2.921,1.626; 3 -2.921,0.965; 4 -2.921,0.33; 5 -2.921,-0.33; 6 -2.921,-0.965; 7 -2.921,-1.626; 8 -2.921,-2.286; 9 2.921,-2.286; 10 2.921,-1.626; 11 2.921,-0.965; 12 2.921,-0.33; 13 2.921,0.33; 14 2.921,0.965; 15 2.921,1.626; 16 2.921,2.286
SOT95P280X100-5N = smd 1.15 x 0.6: 1 -1.25,0.95; 2 -1.25,0; 3 -1.25,-0.95; 4 1.25,-0.95; 5 1.25,0.95
LPC-50M2LG = drill 0.7 pad 1.3 square: 1 0,2 | drill 0.7 pad 1.3: 2 0,0; 3 2,2; 4 2,0; 5 4,2; 6 4,0; 7 6,2; 8 6,0; 9 8,2; 10 8,0; 11 10,2; 12 10,0; 13 12,2; 14 12,0; 15 14,2; 16 14,0; 17 16,2; 18 16,0; 19 18,2; 20 18,0; 21 20,2; 22 20,0; 23 22,2; 24 22,0; 25 24,2; 26 24,0; 27 26,2; 28 26,0; 29 28,2; 30 28,0; 31 30,2; 32 30,0; 33 32,2; 34 32,0; 35 34,2; 36 34,0; 37 36,2; 38 36,0; 39 38,2; 40 38,0; 41 40,2; 42 40,0; 43 42,2; 44 42,0; 45 44,2; 46 44,0; 47 46,2; 48 46,0; 49 48,2; 50 48,0
BIRDS3_CAM_MSN_SOT346-R = smd 0.7 x 0.9: 1 0.95,-1.05; 2 -0.95,-1.05; 3 0,1.05
HDRVR24W40P127_2X12_1564X310X455B = drill 0.7 pad 1.016: 1 0,0; 2 1.27,0; 3 2.54,0; 4 3.81,0; 5 5.08,0; 6 6.35,0; 7 7.62,0; 8 8.89,0; 9 10.16,0; 10 11.43,0; 11 12.7,0; 12 13.97,0; 13 13.97,1.27; 14 12.7,1.27; 15 11.43,1.27; 16 10.16,1.27; 17 8.89,1.27; 18 7.62,1.27; 19 6.35,1.27; 20 5.08,1.27; 21 3.81,1.27; 22 2.54,1.27; 23 1.27,1.27; 24 0,1.27
B14B-PASK-1 = drill 0.7: P$1 28,3.5; P$2 26,3.5; P$3 24,3.5; P$4 22,3.5; P$5 20,3.5; P$6 18,3.5; P$7 16,3.5; P$8 14,3.5; P$9 12,3.5; P$10 10,3.5; P$11 8,3.5; P$12 6,3.5; P$13 4,3.5; P$14 2,3.5 | hole 1.1: 29.5,5.6; 0.5,5.6
BIRDS5_LTC4361 = smd 0.25 x 0.7: 1 -0.675,-0.925; 2 -0.225,-0.925; 3 0.225,-0.925; 4 0.675,-0.925; 5 0.675,0.925; 6 0.225,0.925; 7 -0.225,0.925; 8 -0.675,0.925 | smd 1.37 x 0.54: 9 0,0
DF61_DF61Y = smd 1.35 x 1.24: P$1 0,0; P$5 4.3,0 | smd 1.15 x 1.7: P$2 0,4.28; P$4 4.5,4.28
SPECIAL_R05P205D/P = drill 0.65 pad 1.422 square: 1 -2.54,0 | drill 0.65 pad 1.422: 2 0,0; 3 7.62,0; 4 10.16,0; 5 12.7,0
BIRDS3_CAM_MSN_SOT65P210X110-6N = smd 1.05 x 0.4: 1 -1.05,0.65; 2 -1.05,0; 3 -1.05,-0.65; 4 1.05,-0.65; 5 1.05,0; 6 1.05,0.65
SSM6K411TU = smd 0.8 x 0.45: P$1 0,1.3; P$2 0,0.65; P$3 0,0; P$4 1.9,0; P$5 1.9,0.65; P$6 1.9,1.3

### Placement (x,y rotation side)
C1  39.7,39 180 bottom
C2  26.3,26.4 270 bottom
C3  35.1,66.4 90 bottom
C4  45.5,22 90 top
C5  50.4,37.7 270 bottom
C6  55,34.1 270 bottom
C8  21.4,66.8 270 bottom
C9  2.6,63.7 180 bottom
C10  35.2,84.5 270 bottom
C11  58.4,84.9 90 top
C12  36.9,55.9 90 bottom
C13  42.6,22.2 270 bottom
C14  35.1,38.1 90 top
C15  29.1,22.4 0 top
C16  33.5,22.6 0 top
C17  36.6,30.7 180 bottom
C18  6,69.4 270 bottom
C19  17.6,66.8 270 bottom
C20  4.7,29.2 90 top
C21  16.5,34.3 0 top
C22  21.8,22.3 90 top
C23  24.6,22.4 0 top
C24  19.3,22.2 90 top
C25  4.7,22.1 90 top
C26  23.5,38.3 0 top
C27  31.5,70 180 bottom
C28  27.7,94.8 180 top
C29  44.5,56.4 270 bottom
C31  32.1,66.4 90 bottom
C32  52.4,34.1 270 bottom
C33  32,38.5 180 top
C35  10.9,17.2 270 bottom
C36  38.2,25.7 0 bottom
K5  26.25,77.09 270 top
K6  67.15,30.25 270 top
K7  48.6,51.59 180 top
K8  88.75,51.79 0 bottom
PS1  62.1,69.7 0 bottom
R1  83.8,64.6 0 top
R2  83.5,51.4 0 top
R3  4.5,73.5 90 bottom
R4  49.2,64 180 top
R5  26,35.6 90 bottom
R6  33.2,73.6 0 bottom
R7  2.2,73.3 90 bottom
R8  3.5,69.4 270 bottom
R9  1.3,69.4 270 bottom
R10  44.4,96.1 180 top
R11  19.3,26.9 90 top
R12  2.1,15.7 90 bottom
R13  52.5,37.7 270 bottom
R14  19.2,30.7 90 top
R15  1.7,11.1 270 bottom
R16  33.7,99.8 0 top
R17  37.8,35.4 90 top
R18  56,37.6 270 bottom
R19  35.3,32.8 90 top
R20  34.3,96.1 0 top
R21  54.9,100.2 180 top
R22  31.2,29.5 90 bottom
R23  59.9,37.4 270 top
R24  87.4,38.4 180 bottom
R25  44.4,100.3 180 top
SV2  42.6,13.31 180 bottom
U1  40.03,44.62 270 bottom
U2  50.33,25.35 90 top
U3  26.18,68.93 180 bottom
U4  46.38,35.55 0 top
U5  10.66,68.59 180 bottom
U6  9.7,27.8 270 top
U7  26,32.1 270 top
U8  38.47,25.45 270 top
U9  40.5,56.12 180 bottom
U$1  22.19,7.24 0 top
U$2  6.01,9.16 270 bottom
U$3  79.58,12.31 90 bottom
U$4  29.7,26.2 90 bottom
U$5  51.2,89.5 0 bottom
U$6  6.4,14.4 270 bottom
U$7  24.05,84.15 270 top
U$8  41.38,85.17 0 top
U$9  70.99,79.75 90 top
U$10  29.2,35.1 0 bottom
U$11  28.4,32.2 90 bottom
U$12  37.6,96.8 0 top
U$13  6.45,18.03 0 bottom
U$14  54.9,97.1 90 top
U$15  30.4,97.5 270 top
U$16  30.4,101.4 270 top

### Tracks (layer width: path | path; a pad name or v marks a point on that pad's centre or on a via)
3.3V_1  (via drill 0.35)
  Top 0.508: v52.4,24.4 71.1,24.4 v71.4,24.7
  pour power2 (isolate 0.254): 44.4,11 44.4,5 48.2,5 48.2,10.4 55.4,10.4 55.4,30.7 44.1,30.7 44.1,11
  pour power2 (isolate 0.254): 68.4,11.7 80.2,11.7 80.2,29.2 68.4,29.2
3.3V_2
  pour power2 (isolate 0.254): 68.5,10.8 68.5,5.1 85.2,5.1 85.2,22.2 80.8,22.2 80.8,10.8
5
  Top 0.305: U$3.3 79.22,14.49 79.2,14.49 76.5,11.78 76.5,3.3 75.6,2.4 27.2,2.4 26.19,3.41 U$1.6
5V  (via drill 0.35)
  Top 0.152: v4.6,15.6 4.4,15.4 4.4,13.2 4.1,12.9 v2.3,12.9
  Bottom 0.152: U$6.8 4.95,15.6 v4.6,15.6
  Bottom 0.305: v86.8,19.9 80.88,19.9 U$3.18 | R12.1 2.1,13.1 v2.3,12.9 2.3,12.35 R15.1
  pour power2 (isolate 0.254): 31.5,10.3 43.2,10.3 43.2,3.8 86.4,3.8 86.4,22.5 98.1,22.5 98.1,-3.7 -0.7,-3.7 -0.7,16.7 5.1,16.7 5.1,8.9 31.5,8.9
6  (via drill 0.35)
  Top 0.305: U$3.22 84.15,14.85 85.61,13.39 v85.61,3.6 | v21.41,3.2 v19.9,3.2 v19.89,3.21
  Bottom 0.305: v85.61,3.6 85.21,3.2 v21.41,3.2 | v19.89,3.21 18.3,3.21 17,4.5 17,8.6 19.3,10.9 25.7,10.9 26.19,10.41 U$1.5
7
  Top 0.305: U$3.4 79.22,15.76 79.2,15.76 75.6,12.15 75.6,4 74.9,3.3 28.8,3.3 28.1,4 28.1,7.15 U$1.8
8
  Top 0.305: U$3.21 84.28,16.12 85.3,17.14 85.3,32.1 83.7,33.7 44.8,33.7 42.8,31.7 42.8,20.4 41.4,19 28.5,19 27.4,17.9 27.4,10.03 U$1.7
9
  Top 0.305: U$3.5 79.22,17.03 79.2,17.03 74.8,12.62 74.8,4.7 74.2,4.1 30.9,4.1 30.19,4.81 U$1.10
10  (via drill 0.35)
  Top 0.305: v29.6,16.6 29.6,17.8 29.9,18.1 42.1,18.1 43.4,19.4 43.4,31.1 45,32.7 82.8,32.7 84.4,31.1 84.4,18.5 83.29,17.39 U$3.20
  Bottom 0.305: v29.6,16.6 29.6,16.3 29.83,16.07 29.83,9.6 U$1.9
11
  Top 0.305: U$3.6 79.22,18.3 79.2,18.3 74,13.09 74,5.3 73.4,4.7 32.5,4.7 32.19,5.01 U$1.12
12  (via drill 0.35)
  Top 0.305: U$3.19 82.96,18.66 83.7,19.4 83.7,30.4 82.3,31.8 v78.5,31.8 | v56.1,31.1 45.5,31.1 44.3,29.9 44.3,19.4 42.1,17.2 32.8,17.2 32.3,16.7 32.3,15.07 32.32,15.06 32.32,14.11 32.3,14.09 v32.3,13.2
  Bottom 0.305: v78.5,31.8 77.8,31.1 v56.1,31.1 | v32.3,13.2 32.3,12.54 32.32,12.52 32.32,9.37 U$1.11
CS  (via drill 0.35)
  Top 0.305: U$1.30 50.19,5.61 50.5,5.3 72.8,5.3 73.4,5.9 73.4,10.8 72.7,11.5 70.4,11.5 69.5,12.4 69.5,16.34 68.94,16.9 48.8,16.9 47.5,15.6 v47.6,15.5
  Bottom 0.305: v47.6,15.5 47.6,13.4 SV2.26
DEV1_PGC
  Top 0.305: U$3.1 78,10.73 78,1.8 77.1,0.9 22.8,0.9 22.19,1.51 U$1.2
DEV2_PGD  (via drill 0.35)
  Top 0.305: U$3.24 82.89,12.31 84,11.2 84,2 83.2,1.2 v79.1,1.2
  Bottom 0.305: v79.1,1.2 21.1,1.2 20.6,1.7 20.6,7.9 21.94,9.24 U$1.1
DEV3_MCLR_MB
  Top 0.305: U$3.2 79.22,13.22 79.2,13.22 77.3,11.31 77.3,3 75.9,1.6 24.7,1.6 24.19,2.11 U$1.4
DEV3_MCLR_S-F  (via drill 0.35)
  Top 0.305: U$3.23 83.92,13.58 84.9,12.6 v84.9,2.4 | v21.31,2 20.1,2 18.8,3.3 18.8,9.2 v19.3,9.7
  Bottom 0.305: v84.9,2.4 84.5,2 v21.31,2 | U$1.3 24.03,9.24 23,10.27 19.87,10.27 v19.3,9.7
DI/O(IC/DLP)  (via drill 0.35)
  Top 0.305: v33.2,16.3 42.3,16.3 42.8,16.8 v47.2,16.8 | v25.4,17.3 10.8,17.3 8.9,15.4 v8.9,10.7
  Bottom 0.305: v47.2,16.8 48.7,16.8 50.2,15.3 U$1.29 | v33.2,16.3 32.19,17.31 29.31,17.31 29.3,17.3 v25.4,17.3 | v8.9,10.7 8.31,10.11 U$2.2
DI/O(PINO)  (via drill 0.35)
  Top 0.305: U$14.2 63.45,96.15 64.6,95 v64.6,90.7 | v73.6,31.99 73.2,31.59 73.2,29.4 75.4,27.2 v75.5,27.3 | v71.6,22.7 70.6,21.7 v68.49,21.7 | v68.3,10.8 67.9,10.4 64.9,10.4 64.19,9.69 U$1.43
  Bottom 0.305: v64.6,90.7 64.6,77.5 69.2,72.9 78,72.9 81.2,69.7 81.2,46.3 78.4,43.5 78.4,34.8 75.59,31.99 v73.6,31.99 | v75.5,27.3 75.5,26.2 72,22.7 v71.6,22.7 | v68.49,21.7 67.7,20.91 67.7,16.2 68.3,15.6 v68.3,10.8
DO(FM_SEL)  (via drill 0.35)
  Top 0.305: v44.3,38.3 44.3,74.3 47.5,77.5 47.5,88.8 49.2,90.5 U$5.P$14
  Bottom 0.305: U$1.44 64.19,6.51 64.7,6 72.7,6 73.3,6.6 73.3,10.6 72.4,11.5 72.2,11.5 72.18,11.52 70.44,11.52 70.12,11.83 69.8,12.1 69.2,12.7 69.2,27.1 66.1,30.2 49.6,30.2 44.3,35.5 v44.3,38.3
DO(HV_SHUTDOWN)  (via drill 0.35)
  Top 0.305: v53.3,91.3 60.9,91.3 63,89.2 63,79.8 68.1,74.7 77.1,74.7 81.2,70.6 v81.2,36.2 | v70.1,19.1 69.8,18.8 66,18.8 v65.5,18.3
  Bottom 0.305: U$5.P$13 48.8,91.4 53.2,91.4 v53.3,91.3 | v81.2,36.2 82.3,35.1 82.3,30 81,28.7 71,28.7 70.1,27.8 v70.1,19.1 | v65.5,18.3 65.5,9.93 U$1.45
GND  (via drill 0.35)
  Top 0.152: v36,96.1 36,96.3 36.5,96.8 U$12.9 | U$12.1 36.92,95.22 v36.4,94.7
  Top 0.508: v57.4,98 56,98 U$14.1 | v26.8,96.2 26.8,94.85 C28.2
  Bottom 0.152: 8.1,15.3 7.88,15.07 U$6.1
  Bottom 0.2: v8.1,15.8 8.1,15.3
  Bottom 0.305: U$2.1 7.2,8.07 v7.2,6.9 | v6.4,12.7 U$6.9 | v10.8,14.8 10.8,16.15 C35.2
  other vias: 1.6,38.5 1.3,43.4 1.5,47.5 1.5,50.9 1.5,55.5 1.7,61 1.7,65.8 1.5,71.6 1.4,76.4 4.7,79.9 11.3,80.7 7.9,82.3 18.3,82.3 20.8,84.9 20.9,89.6 45,85.6 60.3,85.2 65.4,85.2 72.3,84.9 76.5,84.9 80.7,84.9 84.8,82.9 89.2,82.7 89.4,79 89.4,75.7 89.6,70.2 89.6,65.9 89.5,58.5 89.9,52.4 89.8,48.7 90.2,39 90.3,34.6 90,32.3 90.1,27 90.1,23.9 90.2,19.6 90.2,15.4 90.2,9.3 89.7,4.5 87.1,3.1 87,1 18.8,0.9 14.1,1.1 8.5,1.3 6.1,3.3 1.6,7 1,13.1 1.5,20.9 1.6,26.9 1.6,33.5 53.3,18.9 76.9,18.6 82.3,28.2 45.7,29.2 40.9,30.8 41.3,36.2 65.2,36.7 76.2,37.1 79.2,47.7 79.1,54.9 79.1,60.1 79.4,65.2 72.5,65 65.1,64.6 58.9,64.8 52.9,65.4 51.3,58.8 51.3,53.3 51.5,48 51.2,43.9 51.3,40.4 54,37.7 58.1,37.9 8.5,64.5 8.4,59.6 8.8,54.6 8.9,49 9,45 8.6,40.5 12.8,39.3 18.8,39.3 27.3,39.5 35.8,39.9 36.2,43.8 35.6,48.2 36.2,53.1 36.1,58.7 36.6,63.5 30.4,65.2 25.2,65.3 19.6,65.3 12.9,64.8 7.4,76.9 14.7,77.1 11.1,74 81.3,74.2 77.8,77.6 80.8,80.3 84.6,76.9 10.8,36 12.6,34 16.7,36.4 71.3,17 73.6,15 68.4,36.4 71.3,39.1 69.2,38 74.1,38.4 74.5,35 70.1,34.7 10.7,38.3 15.8,38.2 14.7,34.3
  pour GND: -13,110.3 -13,-8.2 102.1,-8.2 102.1,110.3
  pour Top (isolate 0.254): -3.7,104.9 -3.7,-4.2 94.9,-4.2 94.9,104.9
  pour Bottom (isolate 0.254): -4.6,106.8 -4.6,-5.6 98.9,-5.6 98.9,106.8
  pour power2 (isolate 0.254): 11,88.9 32.9,88.9 32.9,88.6 32.9,31.3 42.3,31.3 42.3,11.3 32.3,11.3 32.3,17.8 29.8,17.8 -2.6,17.8 -2.6,21 -2.6,88.9
  pour power2 (isolate 0.254): 69.8,88.1 97.9,88.1 97.9,24.6 97.9,23.4 81.2,23.4 81.2,29.8 68.7,29.8 68.7,88.1
MISO  (via drill 0.35)
  Top 0.305: U$1.32 52.19,6.31 52.5,6 72.3,6 72.7,6.4 72.7,10.4 72.4,10.7 69.6,10.7 68.8,11.5 68.8,15.8 68.6,16 v52.9,16 | v52.4,17.7 51.9,18.2 44.59,18.2 v43.9,17.51
  Bottom 0.305: v52.9,16 52.3,16.6 52.3,17.6 v52.4,17.7 | v43.9,17.51 43.9,14.61 SV2.21
MOSI  (via drill 0.35)
  Top 0.305: U$1.31 52.19,10.21 51.7,10.7 v48,10.7
  Bottom 0.305: v48,10.7 47.9,10.6 44,10.6 43.5,10.6 43.3,10.6 42.6,11.3 42.6,13.4 41.42,14.58 SV2.19
N$2  (via drill 0.35)
  Top 0.2: R20.1 32.8,96.1 v32.6,95.9 | v29.6,96.9 29.6,97.3 29.8,97.5 U$15.P$3
  Bottom 0.2: v32.6,95.9 30.4,95.9 29.6,96.7 v29.6,96.9
N$3
  Top 0.2: U$16.P$3 30.5,101.3 30.5,100.86 31.13,100.23 32.12,100.23 32.55,99.8 R16.1
N$5  (via drill 0.35)
  Top 0.152: v37.57,99 37.38,98.8 U$12.7 | v39.5,98.9 39.9,99.3 41,99.3
  Top 0.2: U$16.P$6 31.7,99.1 31.8,99 35.3,99 37,100.7 40.8,100.7 41.2,100.3 R25.2 | U$16.P$5 31.05,98.95 31.4,98.6 35.4,98.6 37.1,100.3 R25.2 | U$16.P$1 31.7,100.9 31.8,100.8 35.4,100.8 35.7,101.1 41.7,101.1 41.4,101.4 40.75,102.05 31.2,102.05 31.05,101.9 U$16.P$2 | U$15.P$5 31.05,94.8 31.85,94 41,94 41.6,94.6 41.6,95.1 | U$15.P$6 31.7,95.1 31.8,95 35.3,95 v35.4,95.1 | 41.1,95.8 v39.8,95.8 | v39.7,96.7 41,96.7 R10.2 | v39.6,97.7 40,97.3 41.4,97.3 41.45,97.25 | U$15.P$2 31.05,96.85 31.3,96.6 32.4,96.6 32.6,96.8 v32.8,96.8 | U$15.P$1 31.8,97.5 32,97.7 v34.4,97.7 | R25.2 41.7,100.4 41.7,100.5
  Top 0.508: 41.7,100.5 41.7,101.1
  Top 0.61: 41.45,97.25 41.6,97.1 R10.2 41.3,95.8 41.1,95.8 | R25.2 41,99.7 41,99.3
  Top 1.016: R25.2 41.6,101.2 41.4,101.4 | R10.2 41.6,95.1
  Top 1.27: R25.2 41.6,97.1
  Bottom 0.152: v39.5,98.9 39.41,99 v37.57,99
  Bottom 0.2: v39.8,95.8 38.5,95.8 38.1,95.4 35.7,95.4 v35.4,95.1 | v39.7,96.7 39.6,96.8 v32.8,96.8 | v39.6,97.7 39.1,97.2 34.9,97.2 v34.4,97.7
N$14
  Bottom 0.152: U$6.4 8.18,13.72
  Bottom 0.2: 8.18,13.72 8.4,13.5 8.4,11.8 7.5,10.9 2.3,10.9 1.8,10.4 1.75,10.4 R15.2
  Bottom 0.305: U$2.3 2.5,9.15 1.7,9.95 R15.2
N$53  (via drill 0.35)
  Top 0.203: v3.7,14.7 3.5,14.9 v3.5,16.2
  Bottom 0.152: U$6.7 3.77,14.62
  Bottom 0.2: 3.77,14.62 v3.7,14.7
  Bottom 0.203: v3.5,16.2 3.05,16.65 R12.2
  Bottom 0.305: U$13.6 4.98,19.1 2.6,19.1 2.1,18.6 R12.2
N$56  (via drill 0.35)
  Top 0.2: v3.6,13.7 2.7,13.7 2.5,13.9 2.5,17.9 2.7,18.1 v3.2,18.1
  Bottom 0.152: U$6.6 4.38,14.18
  Bottom 0.2: v3.6,13.7 3.9,13.7 4.38,14.18
  Bottom 0.305: U$13.2 8.67,18.03 8.8,17.9 8.8,17.1 8.21,16.51 7.81,16.51 7.8,16.5 4.6,16.5 4.2,16.9 4.2,17.8 3.9,18.1 v3.2,18.1
N$66  (via drill 0.35)
  Top 0.152: U$12.4 38.27,95.42 38.7,95 v38.8,95
  Top 0.305: R21.2 54,100.2 v52.7,98.9 53.85,97.75 U$14.3
  Bottom 0.152: v38.8,95 47.6,95 48.6,96 48.6,97.6 49.5,98.5 52.3,98.5 v52.7,98.9
N$75  (via drill 0.35)
  Top 0.152: v35.24,99.94 35.2,99.9 34.45,99.9 R16.2 | U$12.6 37.83,98.22 38.42,98.83 38.42,99.42 v38.2,99.65 36.95,99.65 35.05,97.75 35.05,96.2 R20.2
  Bottom 0.152: v35.24,99.94 35.26,99.96 37.94,99.96 38.2,99.7 v38.2,99.65
PINO_UNREG_2  (via drill 0.35)
  Top 0.152: v37.6,94.7 37.83,94.92 U$12.3
  Top 0.305: U$16.P$4 30.4,99.1 30.1,98.8 29,98.8 v28.8,99 | U$15.P$4 v29.6,95.6
  Top 1.016: v28.2,96.2 28.44,95.96 28.44,94.91 C28.1 29.2,94.15 | U$5.P$4 29.2,94.15 | 29.2,94.15 30.05,94.15 U$5.P$5
  pour power2 (isolate 0.254): 33.6,105.9 33.6,96.2 38.7,96.2 38.7,90.4 17.1,90.4 17.1,105.9
RASPBERRYPI5V  (via drill 0.35)
  Bottom 0.152: U$6.3 8.88,14.18
  Bottom 0.2: C35.1 10.7,18.15 9.8,18.15 9.38,17.73 9.28,14.58 8.88,14.18
  Bottom 0.305: U$13.1 10.17,18.68 10.7,18.15
  Bottom 0.406: C35.1 12.8,18.15 v12.8,16.1
  pour power2 (isolate 0.254): 6.5,16.7 6.5,10.3 30.6,10.3 30.6,16.7
RXD
  Top 0.305: SV2.10 30.28,10.4 47.2,10.4 48.19,9.41 U$1.27
RXD_PINO  (via drill 0.35)
  Top 0.305: v74.1,17.6 74.1,23.8 71.7,26.2 v50,26.2 | v38.5,32.9 38.5,34.11 38.63,34.24 38.63,36.56 38.5,36.69 v38.5,76
  Bottom 0.305: U$1.42 62.19,5.91 62.7,5.4 74.7,5.4 75.1,5.8 75.1,15.5 74.1,16.5 v74.1,17.6 | v50,26.2 44.1,26.2 44,26.1 38.5,31.6 v38.5,32.9 | v38.5,76 38.5,80.6 36.8,82.3 36.8,88.6 39.6,91.4 42.5,91.4 43.2,92.1 U$5.P$11
SCK_PINO  (via drill 0.35)
  Top 0.305: U$5.P$7 35.2,81.4 40.5,76.1 v40.5,32.9 | v47.9,27.1 72.4,27.1 75.5,24 v75.7,24
  Bottom 0.305: v47.9,27.1 47.9,27.2 46.2,27.2 v40.5,32.9 | v75.7,24 75.7,4.7 60.9,4.7 60.19,5.41 U$1.40
SCLK
  Top 0.305: U$1.33 52.8,10.63 52.8,13 52.5,13.3 47.7,13.3 SV2.23
SDI_PINO  (via drill 0.35)
  Top 0.305: U$5.P$10 44.1,90.1 44.1,77.2 43.1,76.2 43.1,40.4 v43.2,40.3 | v62.6,31.99 63.3,31.29 v63.3,29.4
  Bottom 0.305: v43.2,40.3 43.9,39.6 45.8,39.6 47.1,38.3 47.1,35.4 50.4,32.1 62.49,32.1 v62.6,31.99 | v63.3,29.4 60.51,26.61 60.51,9.56 U$1.39
SDO_PINO  (via drill 0.35)
  Top 0.305: v77.5,20.5 77.4,20.6 77.4,24 73.5,27.9 55,27.9 54.4,28.5 v54.4,29.2 | v43.1,33.6 42,34.7 42,35.9 42.01,35.91 42.01,36.49 42,36.5 42,81.8 42.9,82.7 42.9,87.8 39.2,91.5 U$5.P$9
  Bottom 0.305: U$1.38 58.19,5.61 59.8,4 77.7,4 77.7,20.3 v77.5,20.5 | v54.4,29.2 47.6,29.2 43.2,33.6 v43.1,33.6
SS_PINO  (via drill 0.35)
  Top 0.305: U$5.P$8 37.2,82.2 40.9,78.5 v40.75,78.35 | v50.3,35.3 63.4,35.3 v63.8,34.9 | v64.9,31.99 64.9,29.7 v63.8,28.61 | v62.1,21 62.1,20 61.4,19.3 58.9,19.3 58.2,18.6 v58,18.6
  Bottom 0.305: v40.75,78.35 40.75,63.55 46.1,58.2 46.1,40.9 48.9,38.1 48.9,35.7 49.3,35.3 v50.3,35.3 | v63.8,34.9 64.9,33.8 v64.9,31.99 | v63.8,28.61 62,26.8 62,21.1 v62.1,21 | v58,18.6 57.9,18.5 57.9,9.53 U$1.37
TXD  (via drill 0.35)
  Top 0.305: SV2.8 26.09,11.29 25.3,10.5 18.5,10.5 17.5,9.5 17.5,5.09 v18.09,4.5 | v19.51,4.2 v21.31,4.2
  Bottom 0.305: v18.09,4.5 18.39,4.2 v19.51,4.2 | v21.31,4.2 47.3,4.2 48.2,5.1 U$1.28
TXD_PINO  (via drill 0.35)
  Top 0.305: v54.5,89.5 54.6,89.6 59.6,89.6 61.04,88.16 61.04,75.36 64,72.4 76.5,72.4 80.11,68.79 80.11,64.91 80.1,64.9 v80.1,39.7 | v68.7,29.8 66.2,29.8 v65.4,29
  Bottom 0.305: U$5.P$12 48.7,89.5 v54.5,89.5 | v80.1,39.7 80.1,35.8 81.1,34.8 81.1,30.7 80.2,29.8 v68.7,29.8 | v65.4,29 62.9,26.5 62.9,9.95 U$1.41
UNREG_2  (via drill 0.35)
  Top 0.152: v36.2,97.9 36.75,97.9 U$12.8
  Top 0.305: U$1.35 U$1.36
  Top 0.508: v50.5,97.2 49.4,96.1 R10.1 48.2,95.1 v49.1,95.1 | v57,100.2 R21.1 | v50.5,101.5 48.4,101.5 R25.1 49.7,100.3 v50.5,99.5
  Top 1.27: R25.1 R10.1
  pour power2 (isolate 0.254): 49.7,5 67.1,5 67.1,106 34.9,106 34.9,96.9 39.7,96.9 39.7,89.8 34.3,89.8 34.3,32.3 56.8,32.3 56.8,9.9 49.7,9.9

### Text on the board
tPlace: * | *
tNames: U$16 | U$15 | U$9 | U$7 | U2
bNames: U$5